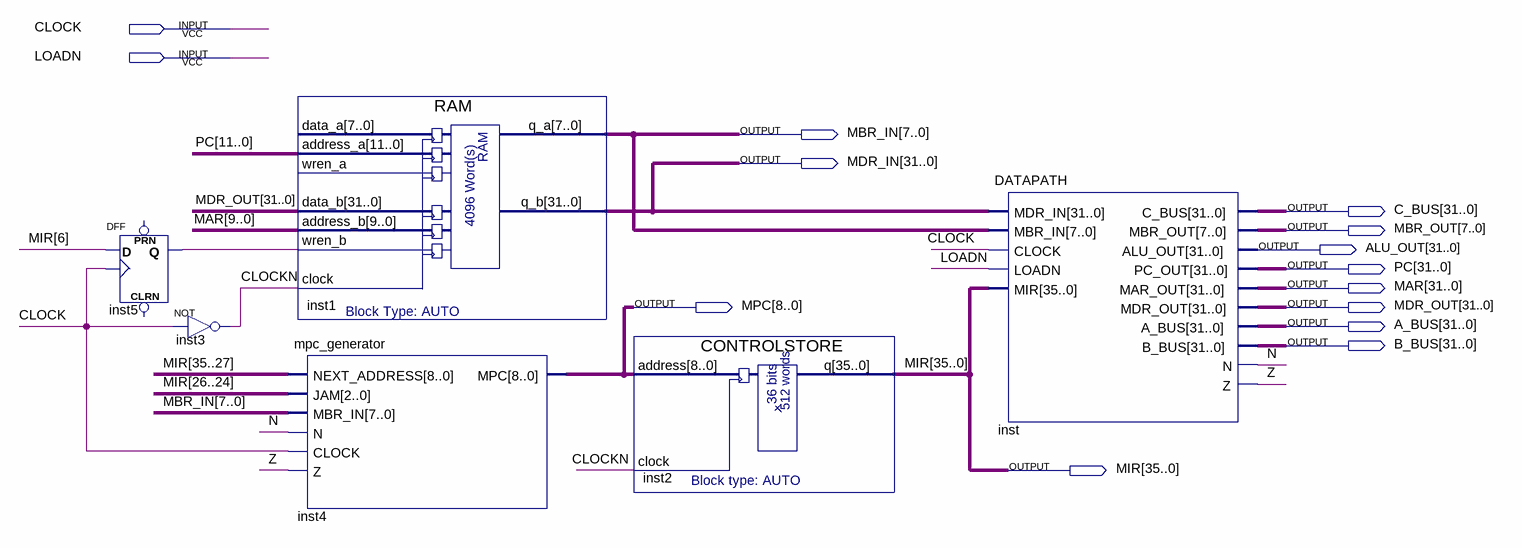
[diagram p0: schematic sheet]
// Quartus schematic CPU.bdf as structural Verilog: 6 symbols, 14 pins
module CPU (
  input  CLOCK,
  input  LOADN,
  output [7:0] MBR_IN,
  output [31:0] MDR_IN,
  output [31:0] C_BUS,
  output [7:0] MBR_OUT,
  output [31:0] ALU_OUT,
  output [31:0] PC,
  output [31:0] MAR,
  output [8:0] MPC,
  output [31:0] MDR_OUT,
  output [31:0] A_BUS,
  output [31:0] B_BUS,
  output [35:0] MIR
);

  wire CLOCKN, inst5_q, N, Z;

  DFF inst5 (.CLK(CLOCK), .D(MIR[6]), .Q(inst5_q));  // open: CLRN, PRN
  not inst3 (CLOCKN, CLOCK);
  RAM inst1 (
    .address_a(PC[11:0]), .data_b(MDR_OUT), .address_b(MAR[9:0]), .wren_b(inst5_q), .clock(CLOCKN),
    .q_a(MBR_IN), .q_b(MDR_IN));  // open: data_a, wren_a
  mpc_generator inst4 (
    .NEXT_ADDRESS(MIR[35:27]), .JAM(MIR[26:24]), .MBR_IN(MBR_IN), .N(N), .CLOCK(CLOCK), .Z(Z), .MPC(MPC));
  CONTROLSTORE inst2 (.address(MPC), .clock(CLOCKN), .q(MIR));
  DATAPATH inst (
    .MDR_IN(MDR_IN), .MBR_IN(MBR_IN), .CLOCK(CLOCK), .LOADN(LOADN), .MIR(MIR), .C_BUS(C_BUS),
    .MBR_OUT(MBR_OUT), .ALU_OUT(ALU_OUT), .PC_OUT(PC), .MAR_OUT(MAR), .MDR_OUT(MDR_OUT), .A_BUS(A_BUS),
    .B_BUS(B_BUS), .N(N), .Z(Z));
endmodule
